# Altium schematic sheet led.SchDoc
size A4; SheetNumber: 1; SheetTotal: 4
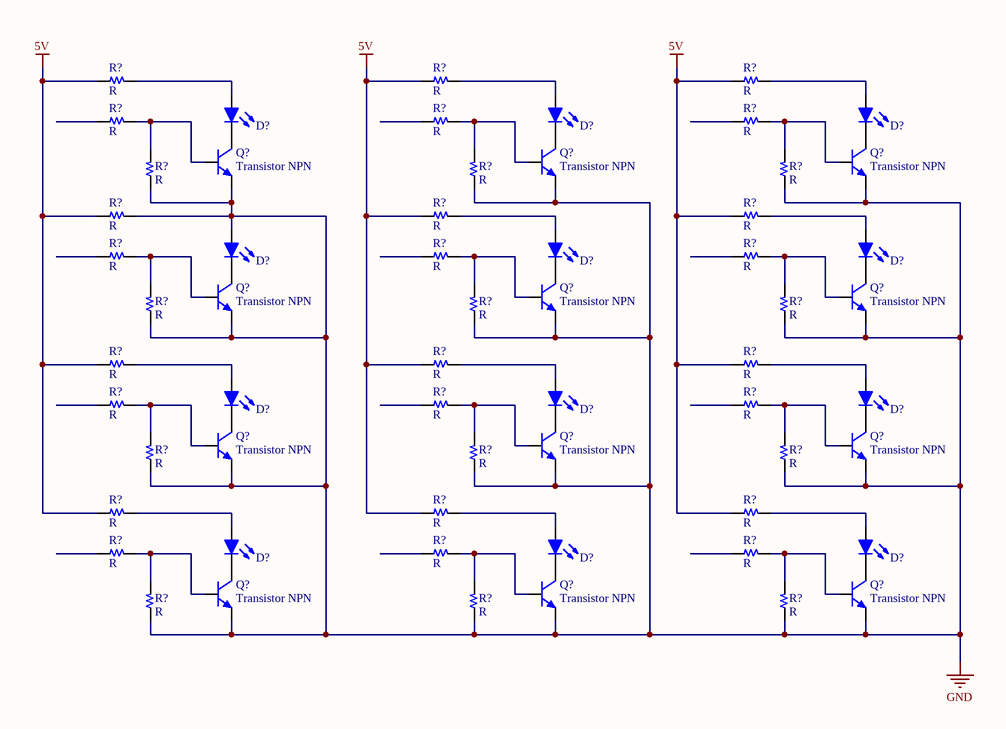
[diagram p0: led.SchDoc]

## Parts
(Parts that share a designator on the sheet are numbered #1, #2 ... from top to bottom, then left to right.)
D?#1  Led  [Led 0805 Blue]  (value not drawn)
D?#2  Led  [Led 0805]  (value not drawn)
D?#3  Led  [Led 0805]  (value not drawn)
D?#4  Led  [Led 0805 Blue]  (value not drawn)
D?#5  Led  [Led 0805]  (value not drawn)
D?#6  Led  [Led 0805]  (value not drawn)
D?#7  Led  [Led 0805 Blue]  (value not drawn)
D?#8  Led  [Led 0805]  (value not drawn)
D?#9  Led  [Led 0805]  (value not drawn)
D?#10  Led  [Led 0805 Blue]  (value not drawn)
D?#11  Led  [Led 0805]  (value not drawn)
D?#12  Led  [Led 0805]  (value not drawn)
Q?#1  Transistor NPN  [SOT-23]
Q?#2  Transistor NPN  [SOT-23]
Q?#3  Transistor NPN  [SOT-23]
Q?#4  Transistor NPN  [SOT-23]
Q?#5  Transistor NPN  [SOT-23]
Q?#6  Transistor NPN  [SOT-23]
Q?#7  Transistor NPN  [SOT-23]
Q?#8  Transistor NPN  [SOT-23]
Q?#9  Transistor NPN  [SOT-23]
Q?#10  Transistor NPN  [SOT-23]
Q?#11  Transistor NPN  [SOT-23]
Q?#12  Transistor NPN  [SOT-23]
R?#1  R  [R 0603]
R?#2  R  [R 0603]
R?#3  R  [R 0603]
R?#4  R  [R 0603]
R?#5  R  [R 0603]
R?#6  R  [R 0603]
R?#7  R  [R 0603]
R?#8  R  [R 0603]
R?#9  R  [R 0603]
R?#10  R  [R 0603]
R?#11  R  [R 0603]
R?#12  R  [R 0603]
R?#13  R  [R 0603]
R?#14  R  [R 0603]
R?#15  R  [R 0603]
R?#16  R  [R 0603]
R?#17  R  [R 0603]
R?#18  R  [R 0603]
R?#19  R  [R 0603]
R?#20  R  [R 0603]
R?#21  R  [R 0603]
R?#22  R  [R 0603]
R?#23  R  [R 0603]
R?#24  R  [R 0603]
R?#25  R  [R 0603]
R?#26  R  [R 0603]
R?#27  R  [R 0603]
R?#28  R  [R 0603]
R?#29  R  [R 0603]
R?#30  R  [R 0603]
R?#31  R  [R 0603]
R?#32  R  [R 0603]
R?#33  R  [R 0603]
R?#34  R  [R 0603]
R?#35  R  [R 0603]
R?#36  R  [R 0603]

## Nets
5V: R?#1.1 R?#2.1 R?#3.1 R?#10.1 R?#11.1 R?#12.1 R?#19.1 R?#20.1 R?#21.1 R?#28.1 R?#29.1 R?#30.1
GND: D?#4.1(A) Q?#1.2(E) Q?#2.2(E) Q?#3.2(E) Q?#4.2(E) Q?#5.2(E) Q?#6.2(E) Q?#7.2(E) Q?#8.2(E) Q?#9.2(E) Q?#10.2(E) Q?#11.2(E) Q?#12.2(E) R?#7.1 R?#8.1 R?#9.1 R?#10.2 R?#16.1 R?#17.1 R?#18.1 R?#25.1 R?#26.1 R?#27.1 R?#34.1 R?#35.1 R?#36.1
NetD?#1_1: D?#1.1(A) R?#1.2
NetD?#1_2: D?#1.2(K) Q?#1.3(C)
NetD?#2_1: D?#2.1(A) R?#2.2
NetD?#2_2: D?#2.2(K) Q?#2.3(C)
NetD?#3_1: D?#3.1(A) R?#3.2
NetD?#3_2: D?#3.2(K) Q?#3.3(C)
NetD?#4_2: D?#4.2(K) Q?#4.3(C)
NetD?#5_1: D?#5.1(A) R?#11.2
NetD?#5_2: D?#5.2(K) Q?#5.3(C)
NetD?#6_1: D?#6.1(A) R?#12.2
NetD?#6_2: D?#6.2(K) Q?#6.3(C)
NetD?#7_1: D?#7.1(A) R?#19.2
NetD?#7_2: D?#7.2(K) Q?#7.3(C)
NetD?#8_1: D?#8.1(A) R?#20.2
NetD?#8_2: D?#8.2(K) Q?#8.3(C)
NetD?#9_1: D?#9.1(A) R?#21.2
NetD?#9_2: D?#9.2(K) Q?#9.3(C)
NetD?#10_1: D?#10.1(A) R?#28.2
NetD?#10_2: D?#10.2(K) Q?#10.3(C)
NetD?#11_1: D?#11.1(A) R?#29.2
NetD?#11_2: D?#11.2(K) Q?#11.3(C)
NetD?#12_1: D?#12.1(A) R?#30.2
NetD?#12_2: D?#12.2(K) Q?#12.3(C)
NetQ?#1_1: Q?#1.1(B) R?#4.2 R?#7.2
NetQ?#2_1: Q?#2.1(B) R?#5.2 R?#8.2
NetQ?#3_1: Q?#3.1(B) R?#6.2 R?#9.2
NetQ?#4_1: Q?#4.1(B) R?#13.2 R?#16.2
NetQ?#5_1: Q?#5.1(B) R?#14.2 R?#17.2
NetQ?#6_1: Q?#6.1(B) R?#15.2 R?#18.2
NetQ?#7_1: Q?#7.1(B) R?#22.2 R?#25.2
NetQ?#8_1: Q?#8.1(B) R?#23.2 R?#26.2
NetQ?#9_1: Q?#9.1(B) R?#24.2 R?#27.2
NetQ?#10_1: Q?#10.1(B) R?#31.2 R?#34.2
NetQ?#11_1: Q?#11.1(B) R?#32.2 R?#35.2
NetQ?#12_1: Q?#12.1(B) R?#33.2 R?#36.2

Not connected (* = marked no-connect by the designer): R?#4 1; R?#5 1; R?#6 1; R?#13 1; R?#14 1; R?#15 1; R?#22 1; R?#23 1; R?#24 1; R?#31 1; R?#32 1; R?#33 1

## Library data of the parts
D?#1-D?#12 = Led: Typical LED
Q?#1-Q?#12 = Transistor NPN: NPN Bipolar Transistor
R?#1-R?#36 = Resistor